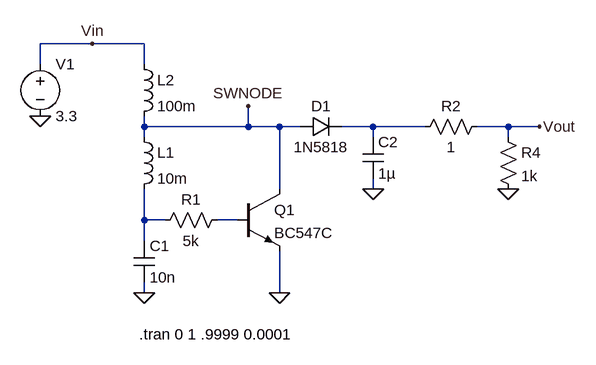
[diagram p0: schematic 09H-18.asc]
09H-18.asc, the LTspice schematic file:
Version 4.1
SHEET 1 880 680
WIRE -16 -64 -96 -64
WIRE 64 -64 -16 -64
WIRE -96 -32 -96 -64
WIRE 64 -32 64 -64
WIRE 64 64 64 48
WIRE 224 64 224 32
WIRE 224 64 64 64
WIRE 272 64 224 64
WIRE 304 64 272 64
WIRE 416 64 368 64
WIRE 496 64 416 64
WIRE 624 64 576 64
WIRE 672 64 624 64
WIRE 64 80 64 64
WIRE 416 80 416 64
WIRE 624 80 624 64
WIRE 272 160 272 64
WIRE 416 160 416 144
WIRE 64 208 64 160
WIRE 96 208 64 208
WIRE 208 208 176 208
WIRE 64 240 64 208
WIRE 64 320 64 304
WIRE 272 320 272 256
FLAG 64 320 0
FLAG 272 320 0
FLAG -96 48 0
FLAG 672 64 Vout
FLAG 416 160 0
FLAG 624 160 0
FLAG -16 -64 Vin
FLAG 224 32 SWNODE
SYMBOL npn 208 160 R0
SYMATTR InstName Q1
SYMATTR Value BC547C
SYMBOL res 192 192 R90
WINDOW 0 0 56 VBottom 2
WINDOW 3 32 56 VTop 2
SYMATTR InstName R1
SYMATTR Value 5k
SYMBOL ind 48 64 R0
SYMATTR InstName L1
SYMATTR Value 10m
SYMBOL cap 48 240 R0
SYMATTR InstName C1
SYMATTR Value 10n
SYMBOL voltage -96 -48 R0
WINDOW 123 0 0 Left 0
WINDOW 39 0 0 Left 0
SYMATTR InstName V1
SYMATTR Value 3.3
SYMBOL ind 48 -48 R0
SYMATTR InstName L2
SYMATTR Value 100m
SYMBOL diode 304 80 R270
WINDOW 0 32 32 VTop 2
WINDOW 3 0 32 VBottom 2
SYMATTR InstName D1
SYMATTR Value 1N5818
SYMATTR Description Diode
SYMATTR Type diode
SYMBOL cap 400 80 R0
SYMATTR InstName C2
SYMATTR Value 1µ
SYMBOL res 592 48 R90
WINDOW 0 0 56 VBottom 2
WINDOW 3 32 56 VTop 2
SYMATTR InstName R2
SYMATTR Value 1
SYMBOL res 608 64 R0
SYMATTR InstName R4
SYMATTR Value 1k
TEXT 56 384 Left 2 !.tran 0 1 .9999 0.0001

The netlist it stands for:
* 09H-18.asc
Q1 SWNODE N003 0 0 BC547C
R1 N003 N002 5k
L1 SWNODE N002 10m
C1 N002 0 10n
V1 Vin 0 3.3
L2 Vin SWNODE 100m
D1 SWNODE N001 1N5818
C2 N001 0 1µ
R2 Vout N001 1
R4 Vout 0 1k
.model D D
.lib standard.dio
.model NPN NPN
.model PNP PNP
.lib standard.bjt
.tran 0 1 .9999 0.0001
.backanno
.end